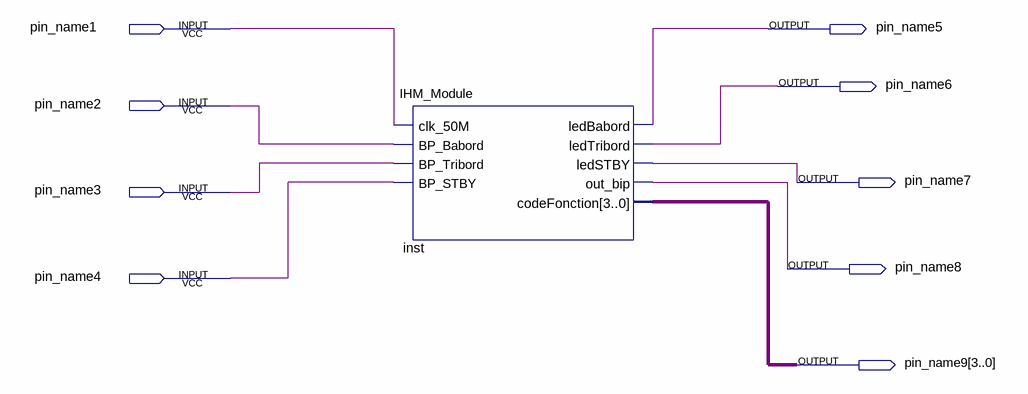
[diagram p0: schematic sheet]
// Quartus schematic Block1.bdf as structural Verilog: 1 symbols, 9 pins
module Block1 (
  input  pin_name1,
  input  pin_name2,
  input  pin_name3,
  input  pin_name4,
  output pin_name5,
  output pin_name6,
  output pin_name7,
  output pin_name8,
  output [3:0] pin_name9
);

  IHM_Module inst (
    .clk_50M(pin_name1), .BP_Babord(pin_name2), .BP_Tribord(pin_name3), .BP_STBY(pin_name4),
    .ledBabord(pin_name5), .ledTribord(pin_name6), .ledSTBY(pin_name7), .out_bip(pin_name8),
    .codeFonction(pin_name9));
endmodule
